# Altium project toaster.PrjPcb
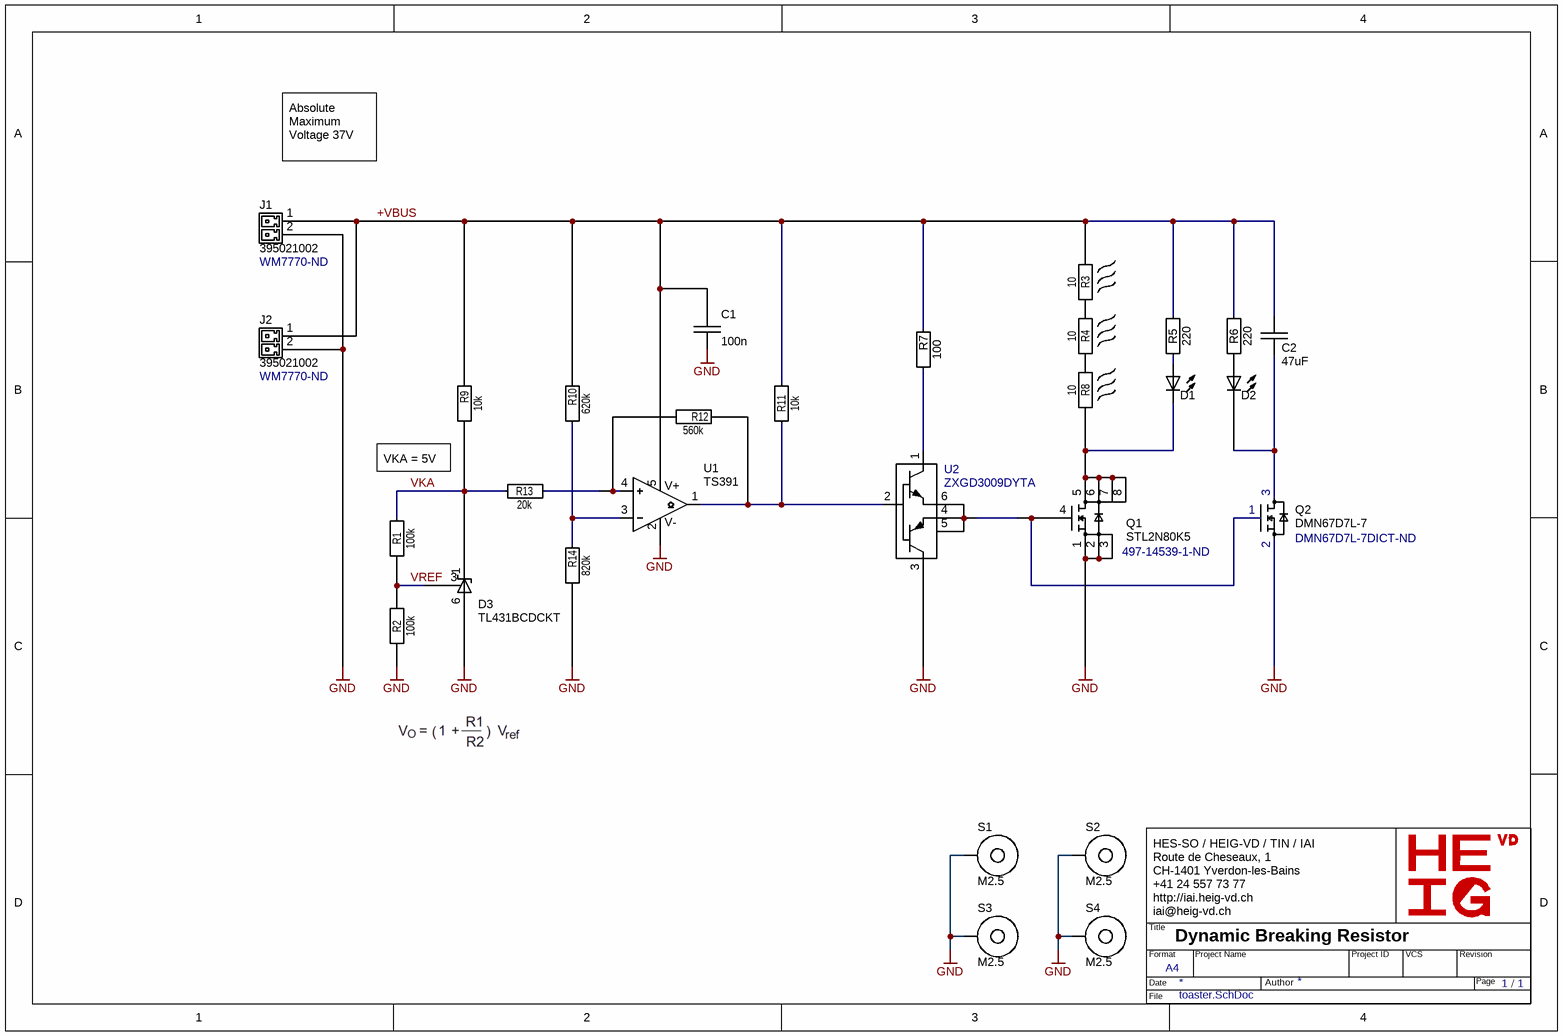
[diagram p0: toaster.SchDoc]
ProjectRevision: 0.1.0
1 sheet, 29 parts. Net scope: global (net labels, ports and power ports of the same name join across sheets).
Board file: toaster.PcbDoc

## Sheet toaster.SchDoc: Dynamic Breaking Resistor
size A4; SheetNumber: 1; SheetTotal: 1

### Parts
C1  100n  [SM/C0603]
C2  47uF  [SM/C0603]
D1  (no value)  [SM/LED0603]
D2  (no value)  [SM/LED0603]
D3  TL431BCDCKT  [SC70-6]
J1  395021002  Supplier Part Number 1: WM7770-ND  [CONN2/PHOENIX/MC 1.5-2-G-3.5-BLACK]
J2  395021002  Supplier Part Number 1: WM7770-ND  [CONN2/PHOENIX/MC 1.5-2-G-3.5-BLACK]
Q1  STL2N80K5  Supplier Part Number 1: 497-14539-1-ND  [PG-TDSON-8_INF]
Q2  DMN67D7L-7  Supplier Part Number 1: DMN67D7L-7DICT-ND  [SOT23-3]
R1  100k  [SM/R0805]
R2  100k  [SM/R0805]
R3  10  [RW5S0FA]
R4  10  [RW5S0FA]
R5  220  [SM/R0603]
R6  220  [SM/R0603]
R7  100  [SM/R0603]
R8  10  [RW5S0FA]
R9  10k  [SM/R0805]
R10  620k  [SM/R0805]
R11  10k  [SM/R0805]
R12  560k  [SM/R0805]
R13  20k  [SM/R0805]
R14  820k  [SM/R0805]
S1  M2.5  [HW/HOLE/M2.5/VIA]  (no BOM)
S2  M2.5  [HW/HOLE/M2.5/VIA]  (no BOM)
S3  M2.5  [HW/HOLE/M2.5/VIA]  (no BOM)
S4  M2.5  [HW/HOLE/M2.5/VIA]  (no BOM)
U1  TS391  [SOT23-5]
U2  ZXGD3009DYTA  [SC70-6]

### Nets
GND: C1.1 D3.6(Anode) J1.2 J2.2 Q1.1(S) Q1.2(S) Q1.3(S) Q2.2(S) R2.1 R14.1 S1.1 S2.1 S3.1 S4.1 U1.2(V-) U2.3(VEE)
+VBUS: C1.2 C2.2 J1.1 J2.1 R3.2 R5.2 R6.2 R7.1 R9.2 R10.2 R11.2 U1.5(V+)
VKA: D3.1(Cathode) R1.2 R9.1 R13.2
VREF: D3.3(Ref) R1.1 R2.2
NetC2_1: C2.1 D2.2 Q2.3(D)
NetD1_1: D1.1 R5.1
NetD1_2: D1.2 Q1.5(D) Q1.6(D) Q1.7(D) Q1.8(D) R8.1
NetD2_1: D2.1 R6.1
NetQ1_4: Q1.4(Gate) Q2.1(G) U2.4(SINK) U2.5(SINK) U2.6(SOURCE)
NetR3_1: R3.1 R4.2
NetR4_1: R4.1 R8.2
NetR7_2: R7.2 U2.1(VCC)
NetR10_1: R10.1 R14.2 U1.3(IN-)
NetR11_1: R11.1 R12.1 U1.1(OUT) U2.2(IN)
NetR12_2: R12.2 R13.1 U1.4(IN+)

### Notes on the sheet
- Absolute Maximum Voltage 37V
- (near R9) VKA = 5V
- HES-SO / HEIG-VD / TIN / IAI
  Route de Cheseaux, 1
  CH-1401 Yverdon-les-Bains
  +41 24 557 73 77
  http://iai.heig-vd.ch
  iai@heig-vd.ch
- Title
- Format
- Date
- A4
- Project Name
- Author
- Project ID
- VCS
- Revision
- Page
- /
- File

### Library data of the parts
C1 C2 = C: Chip Capacitor; Voltage: 16V; Dielectric: X7R; Supplier 2 Part Number: 1292-1393-1-ND; Supplier 2: Digi-Key
D1 D2 = LED: Supplier 1: Digi-Key; Supplier Part Number 1: 492-1325-1-ND
D3 = D ZENER ADJ: IC VREF SHUNT ADJ 0.5% SC70-6; Supplier 1: Digi-Key; Value: TL431BCDCKT; Supplier Part Number 1: 296-TL431BCDCKTCT-ND
J1 J2 = CONN 2 PHOENIX 3.5 mm: TERM BLOCK HDR 2POS 90DEG 3.5MM BLACK; Imax: 8A; Supplier 1: Digi-Key
Q1 = BSC0502NSIATMA1: MOSFET N-CH 800V 2A POWERFLATN-Channel 800 V 2A (Tc) 33W (Tc) Surface Mount PowerFlat™ (5x6); Value: STL2N80K5; Supplier 1: Digi-Key
Q2 = FDN335: MOSFET N-CH 60V 210MA SOT23-3; Value: DMN67D7L-7; Supplier 1: Digi-Key
R1 R2 R5-R7 R9-R14 = R: Chip Resistor SMD
R3 R4 R8 = RT: Chip Resistor SMD; Supplier 1: Digi-Key; Supplier Part Number 1: RW5S0FA10R0JE-ND
S1-S4 = HOLE/M2.5
U2 = ZXGD3009DY: IC GATE DRVR LOW-SIDE SOT363; Value: ZXGD3009DYTA; Supplier 1: Digi-Key; Supplier Part Number 1: ZXGD3009DYTADICT-ND
U1 = TS391: Supplier 1: Digi-Key; Value: TS391; Supplier Part Number 1: TS391SN2T1GOSCT-ND